# Altium schematic sheet Display.SchDoc
size A4; SheetNumber: 6; SheetTotal: 7
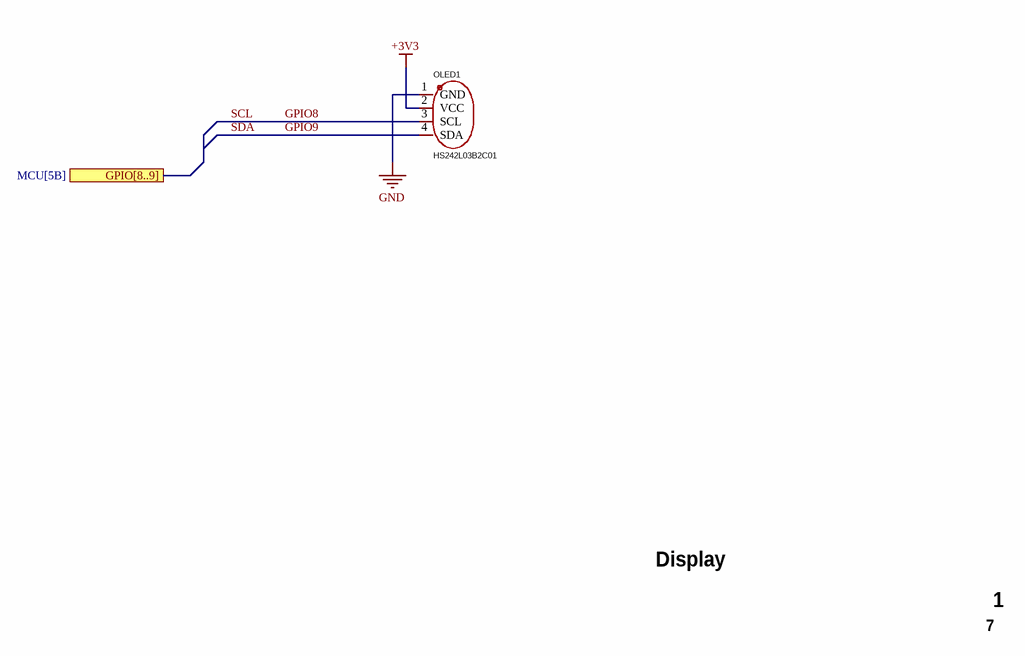
[diagram p0: Display.SchDoc]

## Parts
OLED1  HS242L03B2C01  [OLED-TH_4P-L72.0-W43.0-P2.54]

## Ports
GPIO[8..9] (see MCU[5B])

## Nets
+3V3: OLED1.2(VCC)
GND: OLED1.1(GND)
GPIO8: OLED1.3(SCL)  [also labelled SCL]
GPIO9: OLED1.4(SDA)  [also labelled SDA]

## Notes on the sheet
- Display
- 7
- 1
- THIS DOCUMENT AND THE DATA DISCLOSED HEREIN OR
- HEREWITH IS THE PROPERTY OF ALTIUM LIMITED AND MAY
- DWG NO:
- REVISION
- REV:
- DESCRIPTION
- DATE
- APPROVED
- BE FREELY DISTRIBUTED IN WHOLE. NO RIGHTS ARE
- RESERVED OR EXPRESS OR IMPLIED WARANTEE GIVEN.
- ENG:
- APPROVALS
- PROJECT
- DSN:
- CHK:
- REFERENCE DOCUMENTS
- PROJECT REVISION:
- TITLE
- DOCUMENT REVISION:
- DESIGN ITEM:
- BOM:
- FAB DWG:
- PCB DWG:
- ASSY DWG:
- SCALE:
- A3
- SIZE
- CAGE CODE
- FILE NAME
- DWG NO.
- SHEET
- OF
- REV

## Library data of the parts
OLED1 = HS242L03B2C01: Manufacturer: HS(汉昇); Add into BOM: yes; Main Control Chip: SSD1309; Interface Type: I2C; Symbol: HS242L03B2C01; Device: HS242L03B2C01; LCSC Part Name: 2.42'2.42寸 128*64 OLED显示屏 I2C通讯 SH1106 蓝光; Supplier Part: C7466000; Manufacturer Part: HS242L03B2C01; Supplier Footprint: -; JLCPCB Part Class: Extended Part; Datasheet: https://atta.szlcsc.com/upload/public/pdf/source/20230720/176F0AF8D37A088395ACB9E2EFE5699A.pdf; Supplier: LCSC; Convert to PCB: yes; Size: 2.42; Operating Temperature: -40℃~+70℃